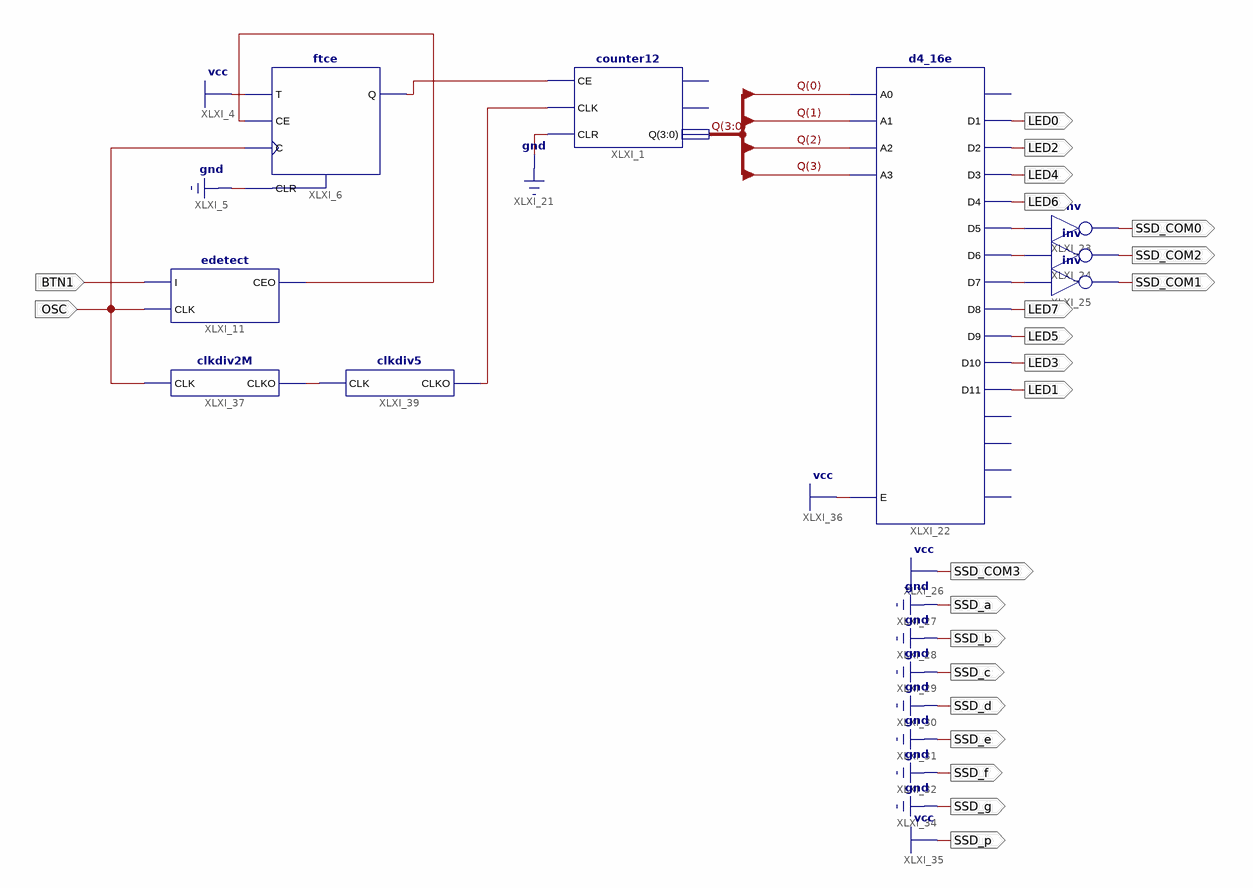
[diagram p0: schematic sheet 1]
// Xilinx ISE schematic main.sch (spartan6) as structural Verilog: 9 symbols, 22 ports
module main (
  input  OSC,
  input  BTN1,
  output LED0,
  output LED2,
  output LED4,
  output LED6,
  output SSD_COM0,
  output SSD_COM2,
  output SSD_COM1,
  output LED7,
  output LED3,
  output LED1,
  output LED5,
  output SSD_COM3,
  output SSD_a,
  output SSD_b,
  output SSD_c,
  output SSD_d,
  output SSD_e,
  output SSD_f,
  output SSD_g,
  output SSD_p
);

  wire XLXN_1, XLXN_7, XLXN_19, XLXN_34, XLXN_35, XLXN_36, XLXN_54;
  wire [3:0] Q;

  counter12 XLXI_1 (.CE(XLXN_1), .CLK(XLXN_19), .CLR(1'b0), .Q(Q));  // open: CEO, TC
  ftce XLXI_6 (.C(OSC), .CE(XLXN_7), .CLR(1'b0), .T(1'b1), .Q(XLXN_1));
  edetect XLXI_11 (.CEO(XLXN_7), .CLK(OSC), .I(BTN1));
  d4_16e XLXI_22 (
    .A0(Q[0]), .A1(Q[1]), .A2(Q[2]), .A3(Q[3]), .E(1'b1), .D1(LED0), .D10(LED3), .D11(LED1), .D2(LED2),
    .D3(LED4), .D4(LED6), .D5(XLXN_34), .D6(XLXN_35), .D7(XLXN_36), .D8(LED7), .D9(LED5));  // open: D0, D12, D13, D14, D15
  not XLXI_23 (SSD_COM0, XLXN_34);
  not XLXI_24 (SSD_COM2, XLXN_35);
  not XLXI_25 (SSD_COM1, XLXN_36);
  clkdiv2M XLXI_37 (.CLK(OSC), .CLKO(XLXN_54));
  clkdiv5 XLXI_39 (.CLK(XLXN_54), .CLKO(XLXN_19));

  assign SSD_a = 1'b0;
  assign SSD_b = 1'b0;
  assign SSD_c = 1'b0;
  assign SSD_COM3 = 1'b1;
  assign SSD_d = 1'b0;
  assign SSD_e = 1'b0;
  assign SSD_f = 1'b0;
  assign SSD_g = 1'b0;
  assign SSD_p = 1'b1;
endmodule
